# EAGLE design WeMosMid400Sensor (EAGLE 9.2.2)
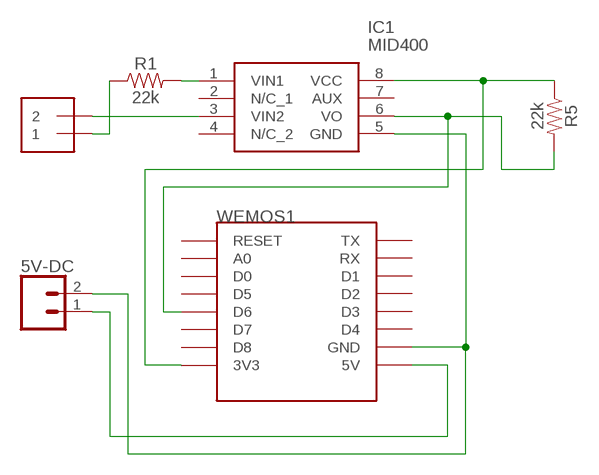
[diagram p0: schematic, sheet 1]

## Parts
5V-DC  CONN_02  [1X02]
A/C  1X2-3.5MM  [1X2-3.5MM]
IC1  MID400  [DIP762W56P254L966H508Q8N]
R1  22k  15KOHM-HORIZ-1/4W-5%  [AXIAL-0.3]
R5  22k  15KOHM-HORIZ-1/4W-5%  [AXIAL-0.3]
WEMOS1  WEMOS-D1-MINI  [WEMOS-D1-MINI]

## Nets
N$1: A/C.1 R1.P$1
N$2: A/C.2 IC1.3(VIN2)
N$3: IC1.1(VIN1) R1.P$2
N$4: 5V-DC.1 WEMOS1.5V
N$5: IC1.6(VO) R5.P$2 WEMOS1.D6
N$6: IC1.8(VCC) R5.P$1 WEMOS1.3V3
N$7: 5V-DC.2 IC1.5(GND) WEMOS1.GND
Unconnected: IC1.2(N/C_1) IC1.4(N/C_2) IC1.7(AUX) WEMOS1.A0 WEMOS1.D0 WEMOS1.D1 WEMOS1.D2 WEMOS1.D3 WEMOS1.D4 WEMOS1.D5 WEMOS1.D7 WEMOS1.D8 WEMOS1.RESET WEMOS1.RX WEMOS1.TX

## Library data of the parts
5V-DC = SparkFun-Connectors:CONN_02: Multi connection point. Often used as Generic Header-pin footprint for 0.1 inch spaced/style header connections On any of the 0.1 inch spaced packages, you can populate with these: Break Away Headers - Straight <https://www.sparkfun.com/products/116> (PRT-00116) Break Away Male Headers - Right Angle <https://www.sparkfun.com/products/553> (PRT-00553) Female Headers <https://www.sparkfun.com/products/115> (PRT-00115) Break Away Headers - Machine Pin <https://www.sparkfun.com/products/117> (PRT-00117) Break Away Female Headers - Swiss Machine Pin <https://www.sparkfun.com/products/743> (PRT-00743) For SCREWTERMINALS and SPRING TERMINALS visit here: Screw Terimnals on SparkFun.com <https://www.sparkfun.com/search/results?term=Screw+Terminals> (5mm/3.5mm/2.54mm spacing) This device is also useful as a general connection point to wire up your design to another part of your project. Our various solder wires solder well into these plated through hole pads. Hook-Up Wire - Assortment (Stranded, 22 AWG) <https://www.sparkfun.com/products/11375> (PRT-11375) Hook-Up Wire - Assortment (Solid Core, 22 AWG) <https://www.sparkfun.com/products/11367> (PRT-11367) View the entire wire category on our website here <https://www.sparkfun.com/categories/141> Special notes: Molex polarized connector foot print use with: PRT-08233 with associated crimp pins and housings. 2.54_SCREWTERM for use with PRT-10571. 3.5mm Screw Terminal footprints for PRT-08084 5mm Screw Terminal footprints for use with PRT-08432
A/C = adafruit:1X2: 3.5mm Terminal block http://www.ladyada.net/library/pcb/eaglelibrary.html
IC1 = MID400:MID400: ON Semiconductor, MID400 Optocoupler Source: Datasheet <http://uk.rs-online.com/web/p/products/7613962P>; DESCRIPTION: ON Semiconductor, MID400 Optocoupler; HEIGHT: 5.08mm; MANUFACTURER_NAME: ON Semiconductor; MANUFACTURER_PART_NUMBER: MID400; RS_PART_NUMBER: 7613962P; RS_PRICE-STOCK: http://uk.rs-online.com/web/p/products/7613962P
R1 R5 = SparkFun-Resistors:15KOHM: 15kΩ resistor A resistor is a passive two-terminal electrical component that implements electrical resistance as a circuit element. Resistors act to reduce current flow, and, at the same time, act to lower voltage levels within circuits. - Wikipedia; PROD_ID: RES-11360; VALUE: 15k
WEMOS1 = esp8266modules:WEMOS-D1-MINI: WeMos.cc D1 mini ESP8266 module

## Board
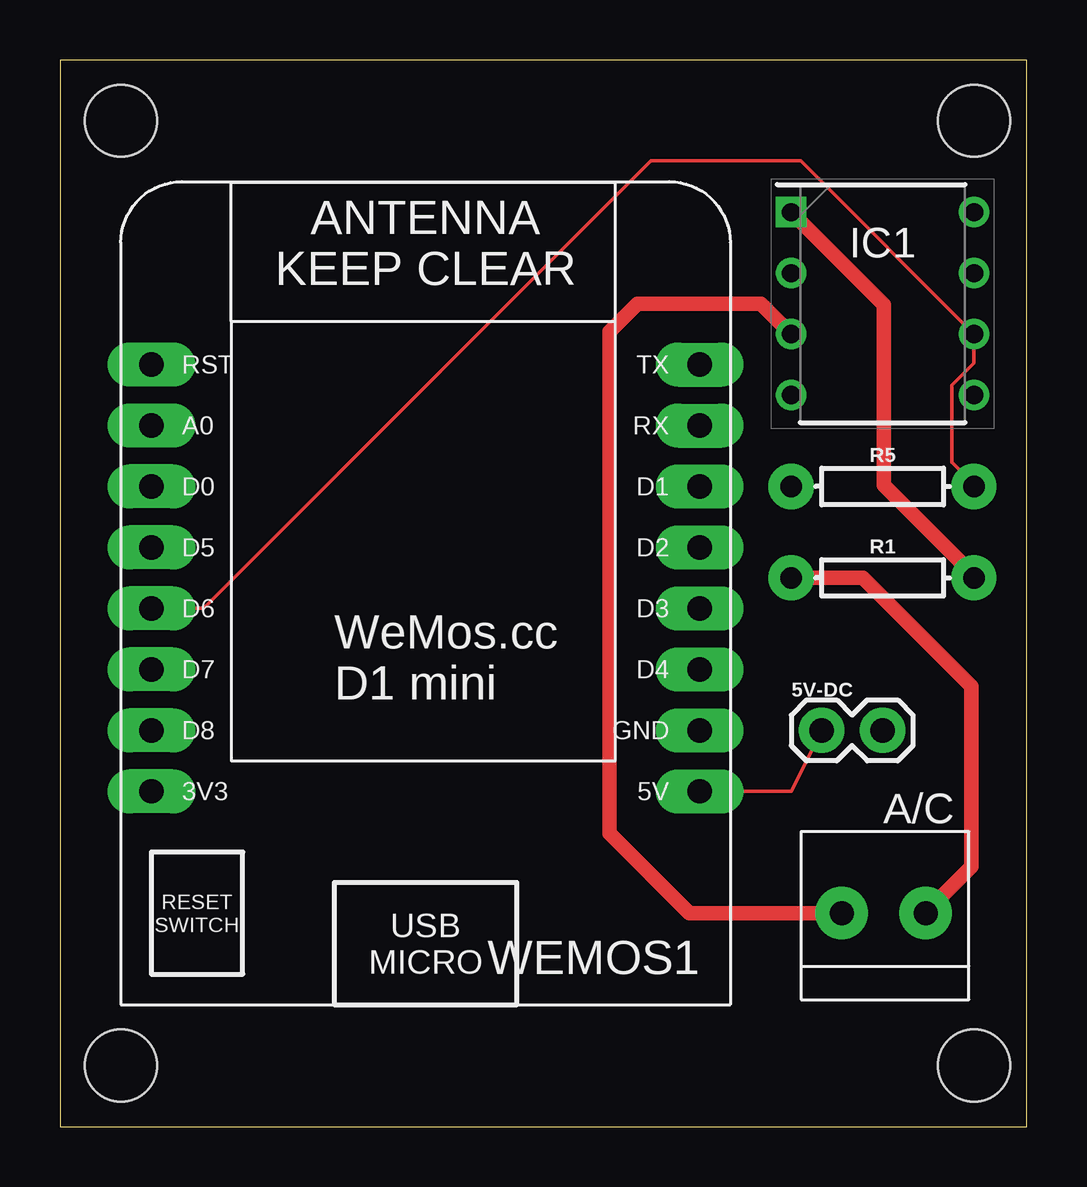
[diagram p1: board, top side]
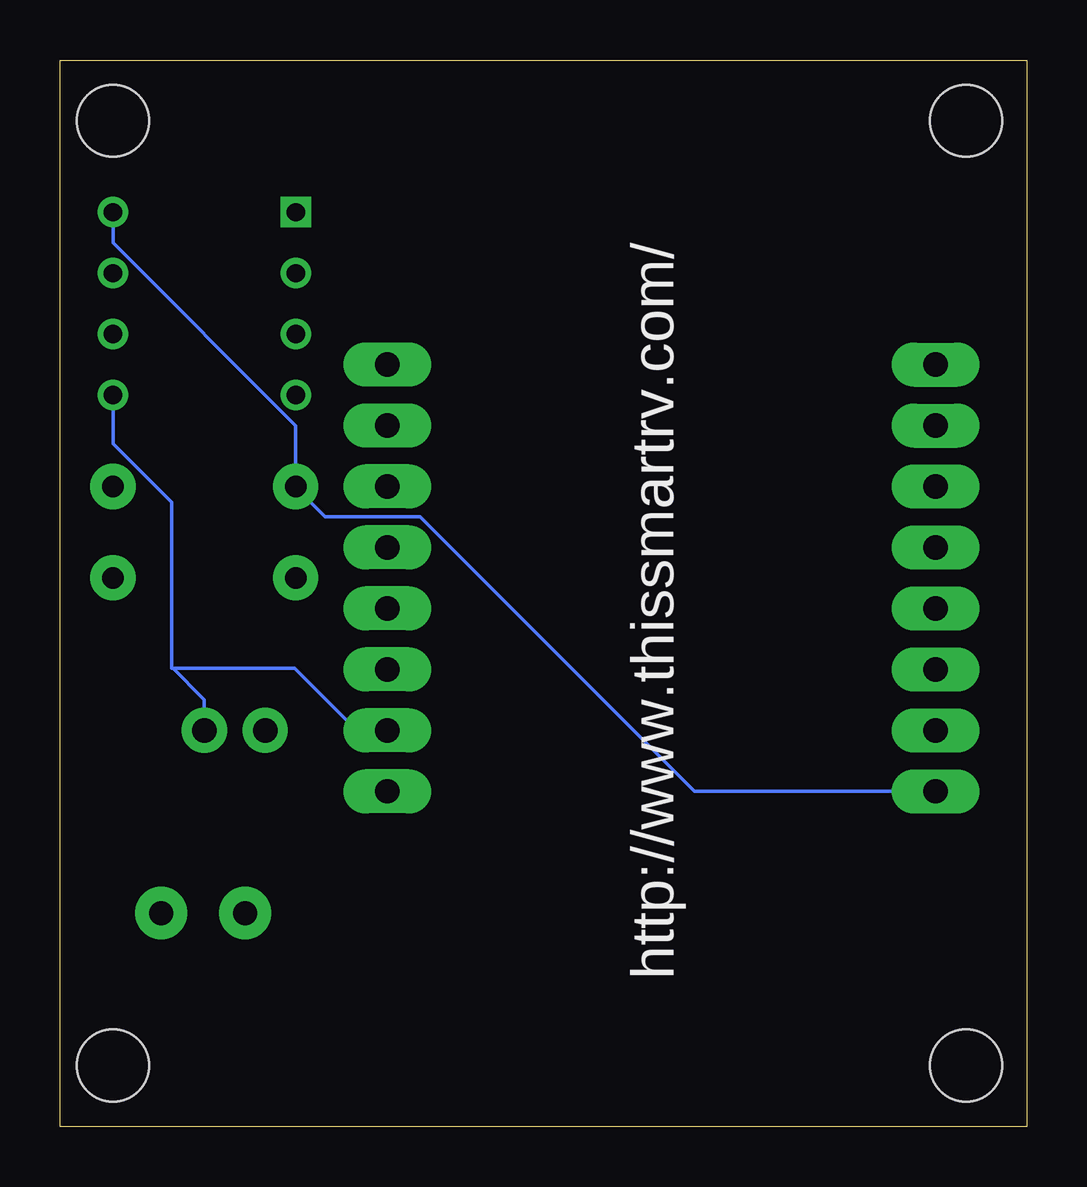
[diagram p2: board, bottom side, seen from below]

Size 40.31 x 44.44 mm. Coordinates in mm from the lower left corner, seen from the top.
Outline: 0,0 40.31,0 40.31,44.44 0,44.44 0,0
Copper layers (1*16): Top 0.035mm / dielectric 1.5mm / Bottom 0.035mm
Design rules "default": minimum track width 6mil, minimum drill 0.35mm, track to track 6mil, track to pad 6mil, pad to pad 6mil, via to via 6mil, smd to smd 6mil, copper to edge 40mil, drill to drill 6mil, minimum pad ring 10mil, minimum via ring 8mil, stop-mask expansion 4mil, vias tented up to drill 0mil, thermal gap 10mil
Holes 3 mm at 2.54,41.91 38.1,41.91 38.1,2.54 2.54,2.54

### Footprints (pad centres in the part's own frame; a part is rotated, then mirrored left to right if it is on the bottom)
1X02 = drill 1.016 pad 1.88: 1 0,0; 2 2.54,0
1X2-3.5MM = drill 1 pad 2.184: 1 1.8,0; 2 -1.7,0
DIP762W56P254L966H508Q8N = drill 0.76 pad 1.16 square: 1 -3.81,3.81 | drill 0.76 pad 1.16: 2 -3.81,1.27; 3 -3.81,-1.27; 4 -3.81,-3.81; 5 3.81,-3.81; 6 3.81,-1.27; 7 3.81,1.27; 8 3.81,3.81
AXIAL-0.3 = drill 0.9 pad 1.88: P$1 -3.81,0; P$2 3.81,0
WEMOS-D1-MINI = drill 1.016 pad 1.829 long: 3V3 -10.16,-10.16; 5V 12.7,-10.16; A0 -10.16,5.08; D0 -10.16,2.54; D1 12.7,2.54; D2 12.7,0; D3 12.7,-2.54; D4 12.7,-5.08; D5 -10.16,0; D6 -10.16,-2.54; D7 -10.16,-5.08; D8 -10.16,-7.62; GND 12.7,-7.62; RESET -10.16,7.62; RX 12.7,5.08; TX 12.7,7.62

### Placement (x,y rotation side)
5V-DC  31.75,16.51 0 top
A/C  34.29,8.89 0 top
IC1  34.29,34.29 0 top
R1  34.29,22.86 0 top
R5  34.29,26.67 0 top
WEMOS1  13.97,24.13 0 top

### Tracks (layer width: path | path; a pad name or v marks a point on that pad's centre or on a via)
N$1
  Top 0.152: 36.12,8.94 A/C.1
  Top 0.61: R1.P$1 33.48,22.86 38,18.34 38,10.82 36.12,8.94
N$2
  Top 0.61: IC1.3 29.21,34.29 24.08,34.29 22.91,33.12 22.91,12.22 26.24,8.89 A/C.2
N$3
  Top 0.152: 38.1,22.96 R1.P$2
  Top 0.61: IC1.1 34.34,34.24 34.34,26.72 38.1,22.96
N$4
  Top 0.152: WEMOS1.5V 30.48,13.97 5V-DC.1
N$5
  Top 0.152: R5.P$2 38.1,26.77 37.19,27.69 37.19,30.89 38.1,31.8 IC1.6 30.89,40.23 24.64,40.23 5.99,21.59 WEMOS1.D6
N$6
  Bottom 0.152: IC1.8 38.1,36.83 30.48,29.21 R5.P$1 30.48,26.62 29.26,25.4 25.3,25.4 13.87,13.97 WEMOS1.3V3
N$7
  Bottom 0.152: IC1.5 38.1,28.45 35.66,26.01 35.66,19.15 | 35.66,19.15 35.66,19.1 30.53,19.1 27.94,16.51 WEMOS1.GND | 35.66,19.15 34.29,17.78 5V-DC.2

### Text on the board
bPlace: http://www.thissmartrv.com/